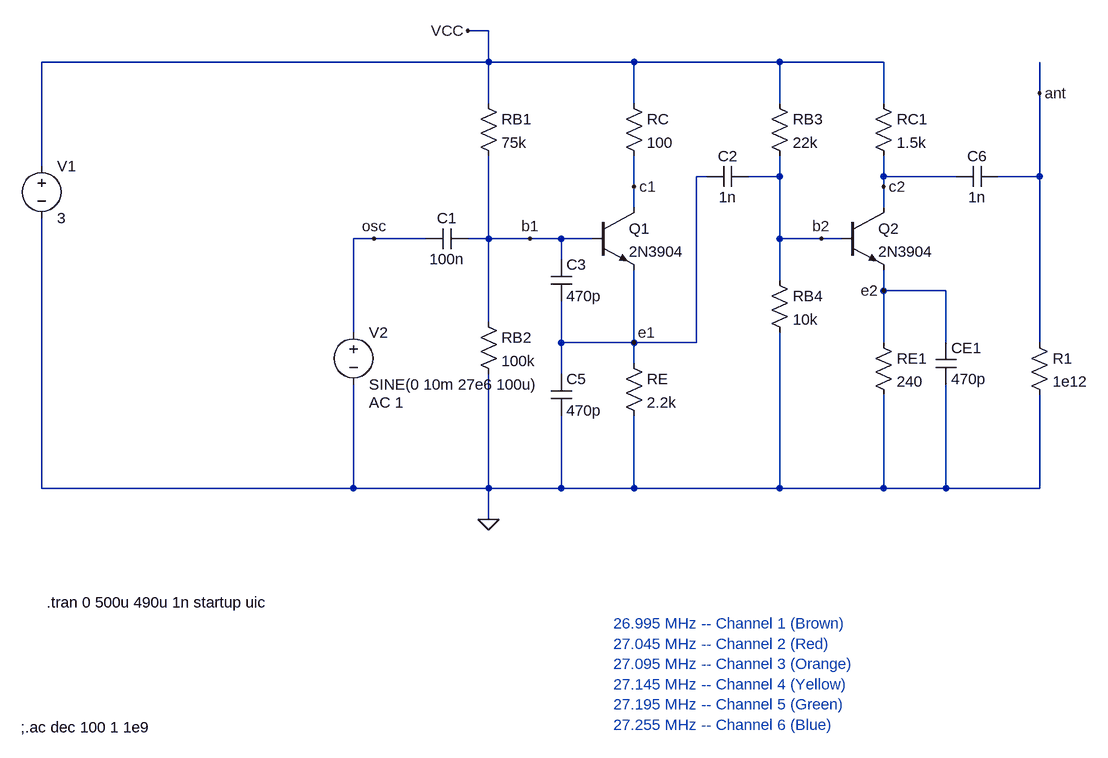
[diagram p0: schematic 02_Bipolar_Biasing.asc]
02_Bipolar_Biasing.asc, the LTspice schematic file:
Version 4
SHEET 1 1392 1184
WIRE 384 96 352 96
WIRE 384 144 384 96
WIRE 384 144 -304 144
WIRE 608 144 384 144
WIRE 832 144 608 144
WIRE 992 144 832 144
WIRE 1232 192 1232 144
WIRE 384 208 384 144
WIRE 608 208 608 144
WIRE 832 208 832 144
WIRE 992 208 992 144
WIRE -304 304 -304 144
WIRE 720 320 704 320
WIRE 832 320 832 288
WIRE 832 320 784 320
WIRE 992 320 992 288
WIRE 1104 320 992 320
WIRE 1232 320 1232 192
WIRE 1232 320 1168 320
WIRE 608 336 608 288
WIRE 992 336 992 320
WIRE 608 368 608 336
WIRE 992 368 992 336
WIRE 208 416 176 416
WIRE 288 416 208 416
WIRE 384 416 384 288
WIRE 384 416 352 416
WIRE 448 416 384 416
WIRE 496 416 448 416
WIRE 544 416 496 416
WIRE 832 416 832 320
WIRE 896 416 832 416
WIRE 928 416 896 416
WIRE 496 448 496 416
WIRE 832 480 832 416
WIRE 992 496 992 464
WIRE 1088 496 992 496
WIRE 384 544 384 416
WIRE 176 560 176 416
WIRE 496 576 496 512
WIRE 608 576 608 464
WIRE 608 576 496 576
WIRE 704 576 704 320
WIRE 704 576 608 576
WIRE 992 576 992 496
WIRE 1088 576 1088 496
WIRE 1232 576 1232 320
WIRE 608 608 608 576
WIRE 496 624 496 576
WIRE -304 800 -304 384
WIRE 176 800 176 640
WIRE 176 800 -304 800
WIRE 384 800 384 624
WIRE 384 800 176 800
WIRE 496 800 496 688
WIRE 496 800 384 800
WIRE 608 800 608 688
WIRE 608 800 496 800
WIRE 832 800 832 560
WIRE 832 800 608 800
WIRE 992 800 992 656
WIRE 992 800 832 800
WIRE 1088 800 1088 640
WIRE 1088 800 992 800
WIRE 1232 800 1232 656
WIRE 1232 800 1088 800
WIRE 384 848 384 800
FLAG 608 336 c1
FLAG 384 848 0
FLAG 448 416 b1
FLAG 352 96 VCC
FLAG 608 576 e1
FLAG 208 416 osc
FLAG 992 336 c2
FLAG 896 416 b2
FLAG 992 496 e2
FLAG 1232 192 ant
SYMBOL voltage -304 288 R0
WINDOW 123 0 0 Left 0
WINDOW 39 0 0 Left 0
SYMATTR InstName V1
SYMATTR Value 3
SYMBOL res 592 192 R0
SYMATTR InstName RC
SYMATTR Value 100
SYMBOL npn 544 368 R0
SYMATTR InstName Q1
SYMATTR Value 2N3904
SYMBOL res 368 192 R0
SYMATTR InstName RB1
SYMATTR Value 75k
SYMBOL res 592 592 R0
SYMATTR InstName RE
SYMATTR Value 2.2k
SYMBOL res 368 528 R0
SYMATTR InstName RB2
SYMATTR Value 100k
SYMBOL cap 288 432 R270
WINDOW 0 32 32 VTop 2
WINDOW 3 0 32 VBottom 2
SYMATTR InstName C1
SYMATTR Value 100n
SYMBOL cap 784 304 R90
WINDOW 0 0 32 VBottom 2
WINDOW 3 32 32 VTop 2
SYMATTR InstName C2
SYMATTR Value 1n
SYMBOL res 976 192 R0
SYMATTR InstName RC1
SYMATTR Value 1.5k
SYMBOL npn 928 368 R0
SYMATTR InstName Q2
SYMATTR Value 2N3904
SYMBOL res 816 192 R0
SYMATTR InstName RB3
SYMATTR Value 22k
SYMBOL res 976 560 R0
SYMATTR InstName RE1
SYMATTR Value 240
SYMBOL cap 1072 576 R0
SYMATTR InstName CE1
SYMATTR Value 470p
SYMBOL res 816 464 R0
SYMATTR InstName RB4
SYMATTR Value 10k
SYMBOL cap 480 448 R0
SYMATTR InstName C3
SYMATTR Value 470p
SYMBOL cap 480 624 R0
SYMATTR InstName C5
SYMATTR Value 470p
SYMBOL voltage 176 544 R0
WINDOW 123 24 124 Left 2
WINDOW 39 0 0 Left 0
SYMATTR Value2 AC 1
SYMATTR InstName V2
SYMATTR Value SINE(0 10m 27e6 100u)
SYMBOL cap 1104 336 R270
WINDOW 0 32 32 VTop 2
WINDOW 3 0 32 VBottom 2
SYMATTR InstName C6
SYMATTR Value 1n
SYMBOL res 1216 560 R0
SYMATTR InstName R1
SYMATTR Value 1e12
TEXT -296 976 Left 2 !.tran 0 500u 490u 1n startup uic
TEXT 576 1008 Left 2 ;26.995 MHz -- Channel 1 (Brown)\n27.045 MHz -- Channel 2 (Red)\n27.095 MHz -- Channel 3 (Orange)\n27.145 MHz -- Channel 4 (Yellow)\n27.195 MHz -- Channel 5 (Green)\n27.255 MHz -- Channel 6 (Blue)
TEXT -336 1168 Left 2 !;.ac dec 100 1 1e9

The netlist it stands for:
* 02_Bipolar_Biasing.asc
V1 VCC 0 3
RC VCC c1 100
Q1 c1 b1 e1 0 2N3904
RB1 VCC b1 75k
RE e1 0 2.2k
RB2 b1 0 100k
C1 osc b1 100n
C2 b2 e1 1n
RC1 VCC c2 1.5k
Q2 c2 b2 e2 0 2N3904
RB3 VCC b2 22k
RE1 e2 0 240
CE1 e2 0 470p
RB4 b2 0 10k
C3 b1 e1 470p
C5 e1 0 470p
V2 osc 0 SINE(0 10m 27e6 100u) AC 1
C6 c2 ant 1n
R1 ant 0 1e12
.model NPN NPN
.model PNP PNP
.lib standard.bjt
.tran 0 500u 490u 1n startup uic
* 26.995 MHz -- Channel 1 (Brown)
* 27.045 MHz -- Channel 2 (Red)
* 27.095 MHz -- Channel 3 (Orange)
* 27.145 MHz -- Channel 4 (Yellow)
* 27.195 MHz -- Channel 5 (Green)
* 27.255 MHz -- Channel 6 (Blue)
;.ac dec 100 1 1e9
.backanno
.end